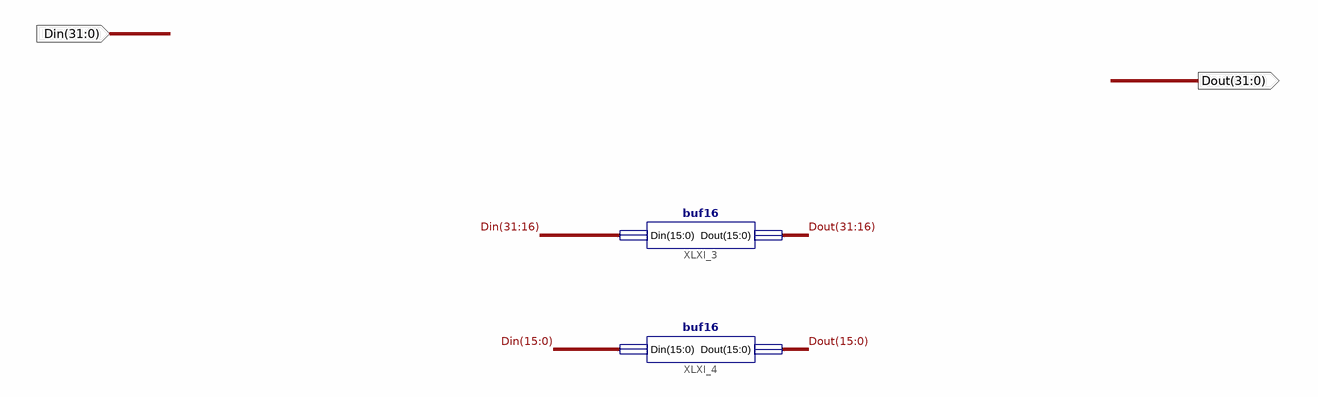
[diagram p0: schematic sheet 1]
// Xilinx ISE schematic BUF32.sch (spartan2) as structural Verilog: 2 symbols, 2 ports
module BUF32 (
  input  [31:0] Din,
  output [31:0] Dout
);

  buf16 XLXI_3 (.Din(Din[31:16]), .Dout(Dout[31:16]));
  buf16 XLXI_4 (.Din(Din[15:0]), .Dout(Dout[15:0]));
endmodule
